# Altium project VFD_controller_stm.PrjPcb
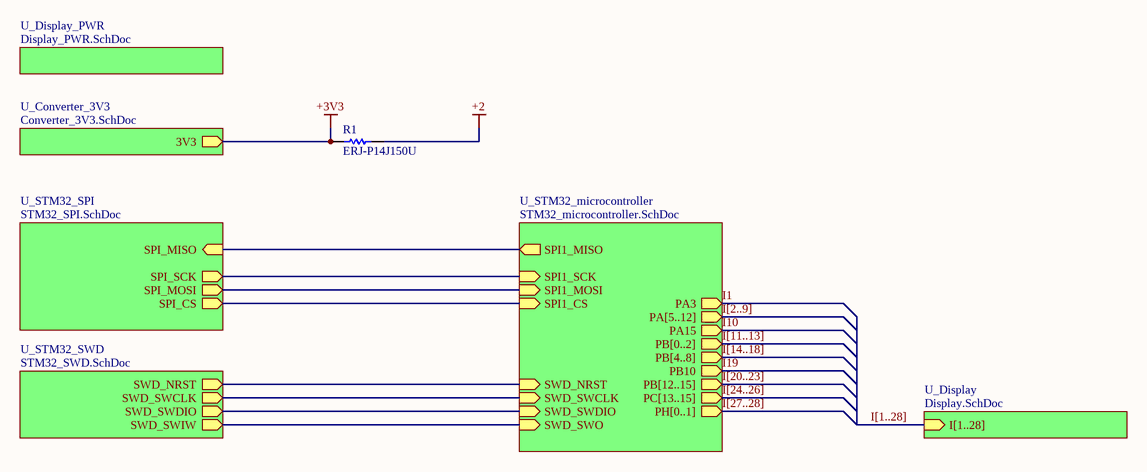
[diagram p0: Main.SchDoc]
7 sheets, 61 parts. Net scope: hierarchical (ports join the sheet entries above them; power ports are global).
Board file: VFD_controller.PcbDoc
Sheets:
  Main.SchDoc
    U_Converter_3V3 = Converter_3V3.SchDoc
    U_STM32_microcontroller = STM32_microcontroller.SchDoc
    U_STM32_SPI = STM32_SPI.SchDoc
    U_Display_PWR = Display_PWR.SchDoc
    U_Display = Display.SchDoc
    U_STM32_SWD = STM32_SWD.SchDoc

## Sheet Main.SchDoc
size A4; SheetNumber: 1; SheetTotal: 7

### Parts
R1  ERJ-P14J150U  [RESC3225X70X50ML20T20]

### Sub-sheets
U_Converter_3V3 = Converter_3V3.SchDoc: 3V3 (out)
U_Display = Display.SchDoc: I[1..28] (in)
U_Display_PWR = Display_PWR.SchDoc: no entries
U_STM32_microcontroller = STM32_microcontroller.SchDoc: SPI1_SCK (in), SPI1_MOSI (in), SPI1_MISO (out), SPI1_CS (in), SWD_SWDIO (in), SWD_SWCLK (in), SWD_NRST (in), SWD_SWO (in), PA3 (out), PA[5..12] (out), PA15 (out), PB[0..2] (out), PB[4..8] (out), PB10 (out), PB[12..15] (out), PC[13..15] (out), PH[0..1] (out)
U_STM32_SPI = STM32_SPI.SchDoc: SPI_SCK (out), SPI_MOSI (out), SPI_CS (out), SPI_MISO (in)
U_STM32_SWD = STM32_SWD.SchDoc: SWD_NRST (out), SWD_SWCLK (out), SWD_SWDIO (out), SWD_SWIW (out)

### Nets
+2: R1.2
+3V3: R1.1 ; sheet U_Converter_3V3/3V3
NRST: sheet U_STM32_microcontroller/SWD_NRST, sheet U_STM32_SWD/SWD_NRST
NetIC1_10: sheet U_STM32_microcontroller/SPI1_MISO, sheet U_STM32_SPI/SPI_MISO
NetIC1_11: sheet U_STM32_microcontroller/SPI1_CS, sheet U_STM32_SPI/SPI_CS
NetIC1_12: sheet U_STM32_microcontroller/SPI1_SCK, sheet U_STM32_SPI/SPI_SCK
NetIC1_14: sheet U_STM32_microcontroller/SPI1_MOSI, sheet U_STM32_SPI/SPI_MOSI
NetIC1_34: sheet U_STM32_microcontroller/SWD_SWDIO, sheet U_STM32_SWD/SWD_SWDIO
NetIC1_37: sheet U_STM32_microcontroller/SWD_SWCLK, sheet U_STM32_SWD/SWD_SWCLK
NetIC1_39: sheet U_STM32_microcontroller/SWD_SWO, sheet U_STM32_SWD/SWD_SWIW

### Buses and harness runs
bus I[1..28] = sheet U_Display/I[1..28]
bus I[2..9] = sheet U_STM32_microcontroller/PA[5..12]
bus I[11..13] = sheet U_STM32_microcontroller/PB[0..2]
bus I[14..18] = sheet U_STM32_microcontroller/PB[4..8]
bus I[20..23] = sheet U_STM32_microcontroller/PB[12..15]
bus I[24..26] = sheet U_STM32_microcontroller/PC[13..15]
bus I[27..28] = sheet U_STM32_microcontroller/PH[0..1]

### Library data of the parts
R1 = CMP-2005-03662-1: Manufacturer: Panasonic; Part Number: ERJ-P14J150U

## Sheet Converter_3V3.SchDoc
size A4; SheetNumber: 3; SheetTotal: 8
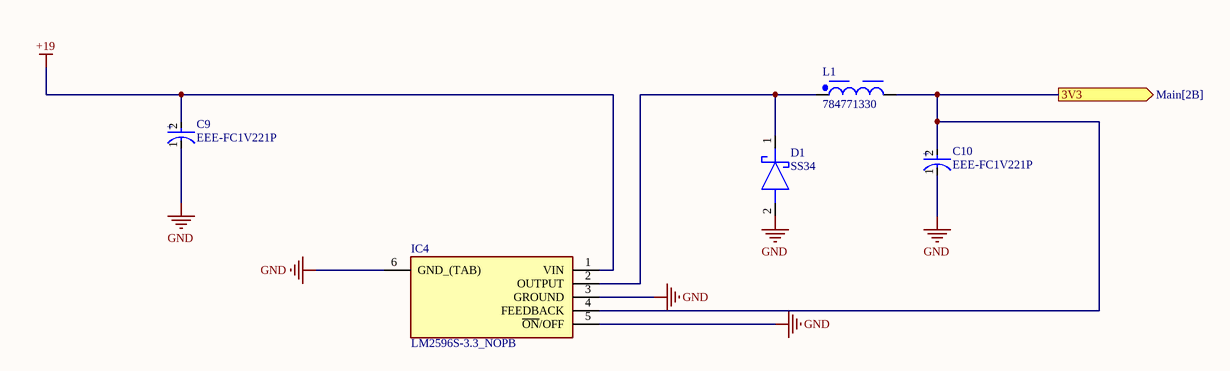
[diagram p1: Converter_3V3.SchDoc]

### Parts
C9  EEE-FC1V221P  [FP-FC-G-MFG]
C10  EEE-FC1V221P  [FP-FC-G-MFG]
D1  SS34  [DIOM8059X256N]
IC4  LM2596S-3.3_NOPB  [TO170P1435X465-6N]
L1  784771330  [WE-PDA_1260]

### Ports
3V3 (out, see Main[2B])

### Nets
+3V3: C10.2(A) IC4.4(FEEDBACK) L1.2 ; port 3V3
+19: C9.2(A) IC4.1(VIN)
GND: C9.1(C) C10.1(C) D1.2(A) IC4.3(GROUND) IC4.5(~{ON}/OFF) IC4.6(GND_(TAB))
NetD1_1: D1.1(K) IC4.2(OUTPUT) L1.1

### Notes on the sheet
- (in symbol CMP-05427-002152-1) +

### Library data of the parts
C9 C10 = CMP-05427-002152-1: CAP ALUM 220UF 20% 35V SMD; Life (Hours): 1000Hour; Leakage Current: 3uA; Ripple Current (AC): 670mA; Material: Aluminium; Impedance: 150mR; Mount: Surface Mount; Construction: Cylindrical; Ratings: AEC-Q200; Radiation Hardening: No; Height: 10.2mm; Height - Seated (Max): 0.402inch; Termination: SMD/SMT; Tolerance: 20%; Packaging: Tape and Reel; Min Operating Temperature: -40°C; Voltage: 35V; Case/Package: Radial; Length: 10.5mm; Ripple Current: 670mA; Contact Plating: Tin; Width: 900um; Capacitance: 220uF; Voltage Rating (DC): 35V; Diameter: 10mm; Package Quantity: 500; Lead Free: Lead Free; Reach SVHC Compliant: Yes; Series: FC; Max Operating Temperature: 105°C; Voltage Rating: 35V; RoHS Compliant: Yes; ESR (Equivalent Series Resistance): 150mR
D1 = SS34: Schottky Diode; Manufacturer_Name: onsemi; Datasheet Link: https://www.onsemi.com/pub/Collateral/SS39-D.PDF; Height: 2.56mm; Manufacturer_Part_Number: SS34; Mouser Part Number: 512-SS34; Mouser Price/Stock: https://www.mouser.co.uk/ProductDetail/onsemi-Fairchild/SS34?qs=2ONuHmP%2FXzb3ub11UdFfdQ%3D%3D; Arrow Part Number: SS34; Arrow Price/Stock: https://www.arrow.com/en/products/ss34/on-semiconductor?utm_currency=USD&region=nac
IC4 = LM2596S-3.3_NOPB: Integrated Circuit; Manufacturer_Name: Texas Instruments; Manufacturer_Part_Number: LM2596S-3.3/NOPB; Datasheet Link: http://www.ti.com/lit/ds/symlink/lm2596.pdf; Height: 4.65mm; Mouser Part Number: 926-LM2596S-3.3/NOPB; Mouser Price/Stock: https://www.mouser.co.uk/ProductDetail/Texas-Instruments/LM2596S-3.3-NOPB?qs=X1J7HmVL2ZHsEwG9Q6doow%3D%3D; Arrow Part Number: LM2596S-3.3/NOPB; Arrow Price/Stock: https://www.arrow.com/en/products/lm2596s-3.3nopb/texas-instruments?utm_currency=USD&region=nac
L1 = CMP-03913-88972560-2: 784771330 Power Inductor, 33Uh, Shielded, 2.8A Rohs Compliant: Yes; DC Resistance (DCR): 52mΩ; Inductance: 33µH; Number of Pins: 2; RoHS: Compliant; Length: 12mm; Min Operating Temperature: -40°C; Max Operating Temperature: 125°C; Ambient Temperature Range High: 85°C; NexarPartId: 88972560; Current Rating: 2.8A; Ambient Temperature Range Low: -40°C; Width: 12mm; Height: 6mm

## Sheet STM32_microcontroller.SchDoc
size A4; SheetNumber: 2; SheetTotal: 7
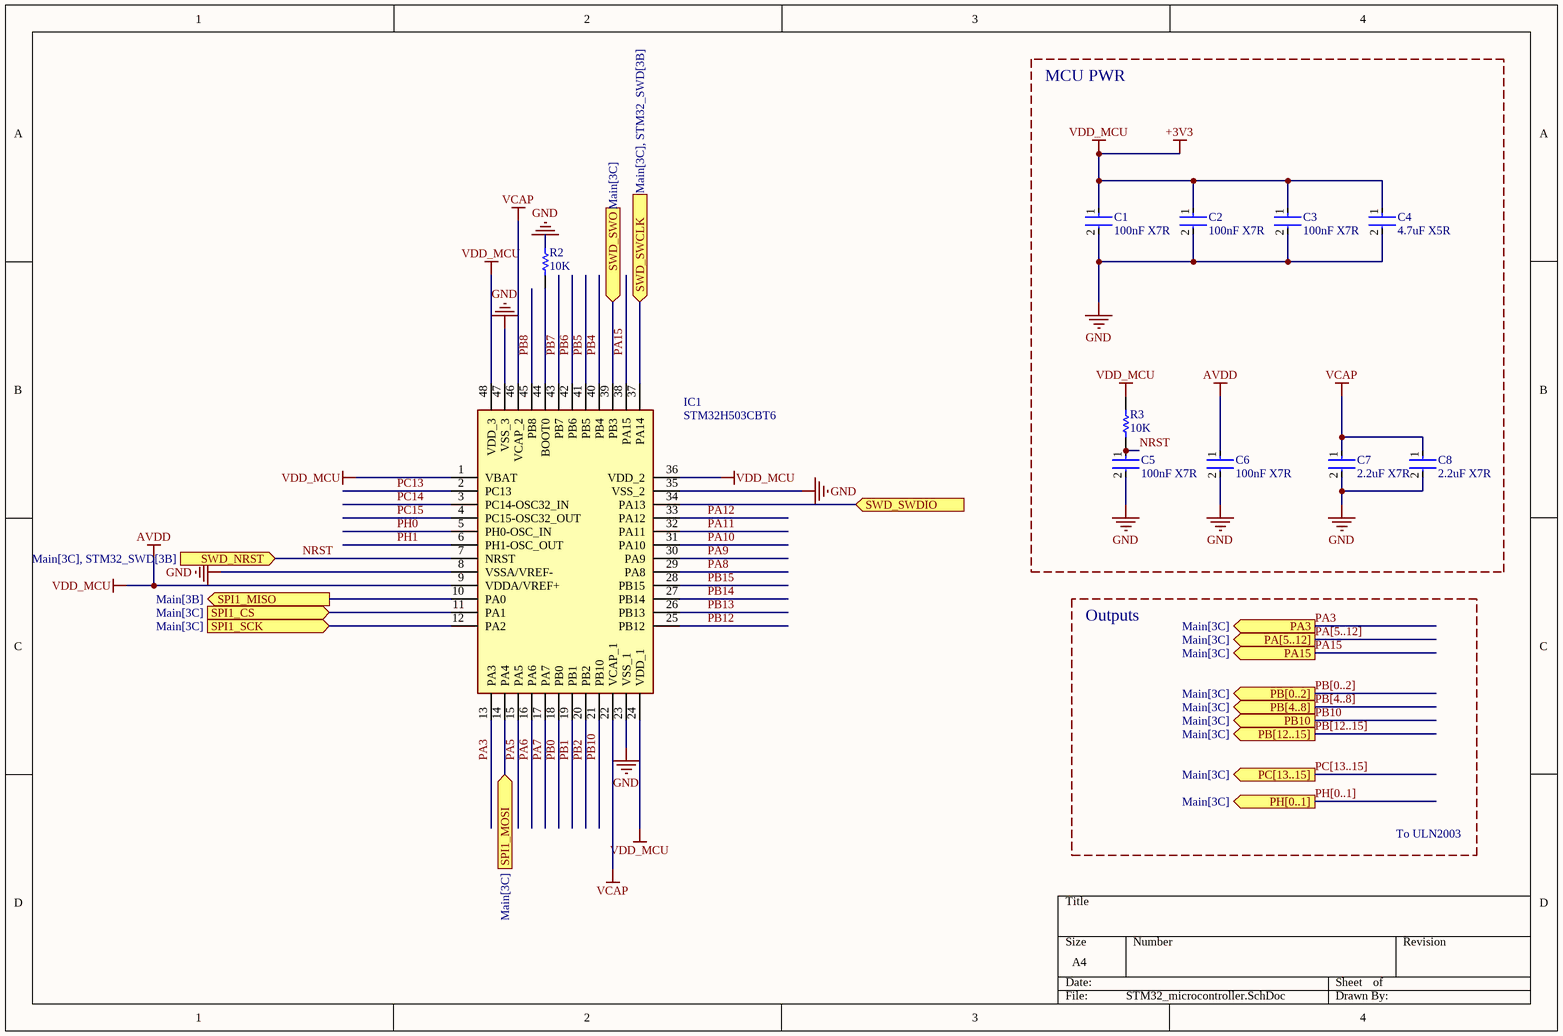
[diagram p2: STM32_microcontroller.SchDoc]

### Parts
C1  100nF X7R  [FP-CL10-IPC_C]
C2  100nF X7R  [FP-CL10-IPC_C]
C3  100nF X7R  [FP-CL10-IPC_C]
C4  4.7uF X5R  [FP-CL21-IPC_B]
C5  100nF X7R  [FP-CL10-IPC_C]
C6  100nF X7R  [FP-CL10-IPC_C]
C7  2.2uF X7R  [FP-CC0805-0_85-MFG]
C8  2.2uF X7R  [FP-CC0805-0_85-MFG]
IC1  STM32H503CBT6  [QFP50P900X900X160-48N]
R2  10K  [RESC1609X50X30ML10T20]
R3  10K  [RESC1609X50X30ML10T20]

### Blocks framed on the sheet
MCU PWR: C1-C8 R3

### Ports
PA3 (out, see Main[3C]), PA15 (out, see Main[3C]), PA[5..12] (out, see Main[3C]), PB10 (out, see Main[3C]), PB[0..2] (out, see Main[3C]), PB[4..8] (out, see Main[3C]), PB[12..15] (out, see Main[3C]), PC[13..15] (out, see Main[3C]), PH[0..1] (out, see Main[3C]), SPI1_CS (in, see Main[3C]), SPI1_MISO (out, see Main[3B]), SPI1_MOSI (in, see Main[3C]), SPI1_SCK (in, see Main[3C]), SWD_NRST (in, see Main[3C], STM32_SWD[3B]), SWD_SWCLK (in, see Main[3C], STM32_SWD[3B]), SWD_SWDIO (in, see Main[3C], STM32_SWD[3B]), SWD_SWO (in, see Main[3C])

### Nets
+3V3: C1.1 C2.1 C3.1 C4.1 C6.1 IC1.1(VBAT) IC1.9(VDDA/VREF+) IC1.24(VDD_1) IC1.36(VDD_2) IC1.48(VDD_3) R3.2  [also labelled AVDD, VDD_MCU]
GND: C1.2 C2.2 C3.2 C4.2 C5.2 C6.2 C7.2 C8.2 IC1.8(VSSA/VREF-) IC1.23(VSS_1) IC1.35(VSS_2) IC1.47(VSS_3) R2.2
VCAP: C7.1 C8.1 IC1.22(VCAP_1) IC1.46(VCAP_2)
NRST: C5.1 IC1.7(NRST) R3.1 ; port SWD_NRST
PA3: IC1.13(PA3) ; port PA3  [project net I1]
PA5: IC1.15(PA5)  [project net I2]
PA6: IC1.16(PA6)  [project net I3]
PA7: IC1.17(PA7)  [project net I4]
PA8: IC1.29(PA8)  [project net I5]
PA9: IC1.30(PA9)  [project net I6]
PA10: IC1.31(PA10)  [project net I7]
PA11: IC1.32(PA11)  [project net I8]
PA12: IC1.33(PA12)  [project net I9]
PA15: IC1.38(PA15) ; port PA15  [project net I10]
PB0: IC1.18(PB0)  [project net I11]
PB1: IC1.19(PB1)  [project net I12]
PB2: IC1.20(PB2)  [project net I13]
PB4: IC1.40(PB4)  [project net I14]
PB5: IC1.41(PB5)  [project net I15]
PB6: IC1.42(PB6)  [project net I16]
PB7: IC1.43(PB7)  [project net I17]
PB8: IC1.45(PB8)  [project net I18]
PB10: IC1.21(PB10) ; port PB10  [project net I19]
PB12: IC1.25(PB12)  [project net I20]
PB13: IC1.26(PB13)  [project net I21]
PB14: IC1.27(PB14)  [project net I22]
PB15: IC1.28(PB15)  [project net I23]
PC13: IC1.2(PC13)  [project net I24]
PC14: IC1.3(PC14-OSC32_IN)  [project net I25]
PC15: IC1.4(PC15-OSC32_OUT)  [project net I26]
PH0: IC1.5(PH0-OSC_IN)  [project net I27]
PH1: IC1.6(PH1-OSC_OUT)  [project net I28]
NetIC1_10: IC1.10(PA0) ; port SPI1_MISO
NetIC1_11: IC1.11(PA1) ; port SPI1_CS
NetIC1_12: IC1.12(PA2) ; port SPI1_SCK
NetIC1_14: IC1.14(PA4) ; port SPI1_MOSI
NetIC1_34: IC1.34(PA13) ; port SWD_SWDIO
NetIC1_37: IC1.37(PA14) ; port SWD_SWCLK
NetIC1_39: IC1.39(PB3) ; port SWD_SWO
NetIC1_44: IC1.44(BOOT0) R2.1

### Buses and harness runs
bus PA[5..12] = port PA[5..12]
bus PB[0..2] = port PB[0..2]
bus PB[4..8] = port PB[4..8]
bus PB[12..15] = port PB[12..15]
bus PC[13..15] = port PC[13..15]
bus PH[0..1] = port PH[0..1]

### Notes on the sheet
- Outputs
- To ULN2003

### Library data of the parts
C1-C3 C5 C6 = CMP-13271-001423-1: Cap Ceramic 100nF 25V X7R ±10% Pad SMD 0603 +125°C T/R; Depth: 0.8mm; Tolerance: 10%; Case Code (Imperial): 0603; Max Operating Temperature: 125°C; Min Operating Temperature: -55°C; Dielectric: X7R; Width: 0.031inch; Thickness: 0.035inch; Height: 0.8mm; Length: 1.6mm; Mount: Surface Mount; Capacitance: 100nF; Voltage Rating: 25V; Case Code (Metric): 1608; Case/Package: 0603; Radiation Hardening: No; Packaging: Tape and Reel
C4 = CMP-13271-001343-1: CL21 Series 0805 4.7uF 6.3V ±10% Tolerance X5R Multilayer Ceramic Chip Capacitor; Case/Package: 0805; Capacitance: 4.7uF; Length: 2mm; Width: 0.049inch; Thickness: 0.053inch; Package Quantity: 10000; Voltage Rating: 6.3V; Depth: 1.25mm; Radiation Hardening: No; Tolerance: 10%; Dielectric: X5R; Height: 1.25mm; Packaging: Tape and Reel; Min Operating Temperature: -55°C; Max Operating Temperature: 85°C; Mount: Surface Mount
C7 C8 = CMP-03422-000945-1: CAP CER 2.2UF 6.3V X7R 0805; Manufacturer Part Number: CC0805KKX7R5BB225; Manufacturer: Yageo; Tolerance: 0.1; Material: Ceramic; ComponentLink2URL: http://www.yageo.com/documents/recent/UPY-GPHC_Y5V_6.3V-to-50V_8.pdf; Package: CC0805-0.85; Temperature Range Low: -30°C; Temperature: -30°C to +85°C; Footprint Url: http://www.yageo.com/exep/pages/download/literatures/UPY-C_GEN_24.pdf; Category: Cap; Lead Free: Yes; Temperature Range High: +85°C; Octopart: https://octopart.com/cc0805kkx7r5bb225-yageo-29810442; Ipc Land Pattern Name: CAPC200125X85; RoHS: TRUE; Capacitance: 2.2 uF; Height: 0.95mm; Value: 2.2 uF; Device Class L1: Passive Components; Automotive: No; Temperature Characteristic: X7R; Device Class L3: Ceramic Capacitors; Voltage Rating: 6.3 V; ComponentLink2Description: Datasheet; Device Class L2: Capacitors; Mouser Description: Multilayer Ceramic Capacitors MLCC - SMD/SMT 2.2uF 6.3V X7R 10%; Digikey Description: CAP CER 2.2UF 6.3V X7R 0805
IC1 = STM32H503CBT6: Integrated Circuit; Manufacturer_Name: STMicroelectronics; Datasheet Link: https://www.st.com/en/microcontrollers-microprocessors/stm32h503cb.html; Height: 1.6mm; Manufacturer_Part_Number: STM32H503CBT6; Mouser Part Number: 511-STM32H503CBT6; Mouser Price/Stock: https://www.mouser.co.uk/ProductDetail/STMicroelectronics/STM32H503CBT6?qs=amGC7iS6iy99sz%2FXgeIPHg%3D%3D; Arrow Part Number: STM32H503CBT6; Arrow Price/Stock: https://www.arrow.com/en/products/stm32h503cbt6/stmicroelectronics?utm_currency=USD&region=nac
R2 R3 = CMP-2000-03837-1: Manufacturer: Vishay Dale; Part Number: CRCW060310K0FKTB

## Sheet STM32_SPI.SchDoc
size A4; SheetNumber: 6; SheetTotal: 8
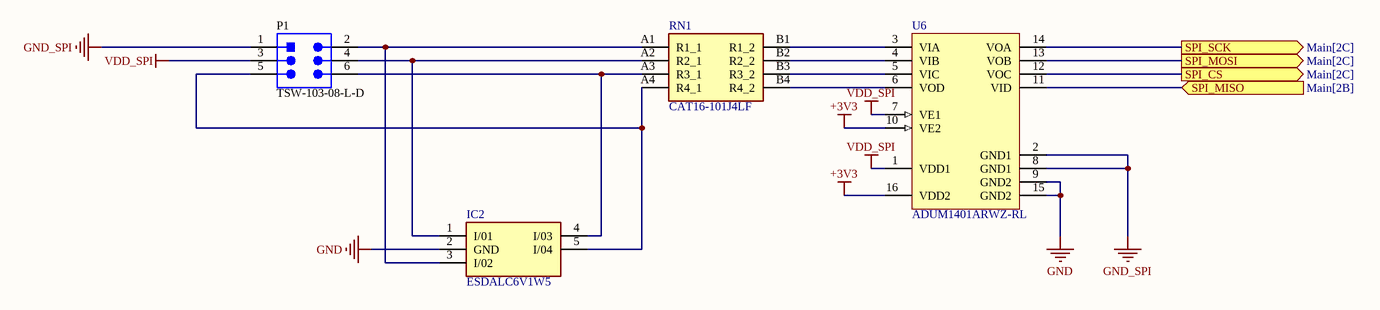
[diagram p3: STM32_SPI.SchDoc]

### Parts
IC2  ESDALC6V1W5  [SOT65P210X110-5N]
P1  TSW-103-08-L-D  [SMTC-TSW-103-08-L-D_V]
RN1  CAT16-101J4LF  [CAT16101J4LF]
U6  ADUM1401ARWZ-RL  [ADI-RW-16_N]

### Ports
SPI_CS (out, see Main[2C]), SPI_MISO (in, see Main[2B]), SPI_MOSI (out, see Main[2C]), SPI_SCK (out, see Main[2C])

### Nets
+3V3: U6.10(VE2) U6.16(VDD2)
GND: IC2.2(GND) U6.9(GND2) U6.15(GND2)
GND_SPI: P1.1 U6.2(GND1) U6.8(GND1)
VDD_SPI: P1.3 U6.1(VDD1) U6.7(VE1)
NetIC1_10: U6.11(VID) ; port SPI_MISO
NetIC1_11: U6.12(VOC) ; port SPI_CS
NetIC1_12: U6.14(VOA) ; port SPI_SCK
NetIC1_14: U6.13(VOB) ; port SPI_MOSI
NetIC2_1: IC2.1(I/01) P1.4 RN1.A2(R2_1)
NetIC2_3: IC2.3(I/02) P1.2 RN1.A1(R1_1)
NetIC2_4: IC2.4(I/03) P1.6 RN1.A3(R3_1)
NetIC2_5: IC2.5(I/04) P1.5 RN1.A4(R4_1)
NetRN1_B1: RN1.B1(R1_2) U6.3(VIA)
NetRN1_B2: RN1.B2(R2_2) U6.4(VIB)
NetRN1_B3: RN1.B3(R3_2) U6.5(VIC)
NetRN1_B4: RN1.B4(R4_2) U6.6(VOD)

### Library data of the parts
IC2 = ESDALC6V1W5: Integrated Circuit; Manufacturer_Name: STMicroelectronics; Datasheet Link: http://www.st.com/web/en/resource/technical/document/datasheet/CD00002946.pdf; Height: 1.1mm; Manufacturer_Part_Number: ESDALC6V1W5; Mouser Part Number: 511-ESDALC6V1W5; Mouser Price/Stock: https://www.mouser.co.uk/ProductDetail/STMicroelectronics/ESDALC6V1W5?qs=C%2FEejvvdwQ4xcyFnfrFaDw%3D%3D; Arrow Part Number: ESDALC6V1W5; Arrow Price/Stock: https://www.arrow.com/en/products/esdalc6v1w5/stmicroelectronics?utm_currency=USD&region=nac
P1 = CMP-1024-00336-5: Male Header, Pitch 2.54 mm, 2 x 3 Position, Height 8.38 mm, Tail Length 5.08 mm, -55 to 125 degC, RoHS, Bulk; Manufacturer: Samtec; DatasheetVersion: 04/2012; ComponentLink3URL: http://suddendocs.samtec.com/prints/tsw-xxx-xx-x-x-xx-xxx-footprint.pdf; PackageReference: TSW-103-08-L-D; Mounting Technology: Through Hole; Min Operating Temperature: -55 degC; ComponentLink2Description: Datasheet; Lead Pitch: 2.54 mm; ComponentLink1Description: Manufacturer URL; Mount: Through Hole; ComponentLink1URL: http://www.samtec.com/; ComponentLink3Description: Package Specification; Max Operating Temperature: 125 degC; PackageDescription: Male Header, Pitch 2.54 mm, 2 x 3 Position, Height 8.38 mm, Tail Length 5.08 mm; ComponentLink2URL: https://datasheet.ciiva.com/25618/0900766b81154476-25618436.pdf; RoHSCompliant: true
RN1 = CAT16-101J4LF: Resistor Network; Manufacturer_Name: Bourns; Datasheet Link: https://datasheet.datasheetarchive.com/originals/distributors/SFDatasheet-7/sf-000140092.pdf; Height: 0.5mm; Manufacturer_Part_Number: CAT16-101J4LF; Mouser Part Number: 652-CAT16-101J4LF; Mouser Price/Stock: https://www.mouser.co.uk/ProductDetail/Bourns/CAT16-101J4LF?qs=Fn3VdHBzkcn2is%252B1oonJSQ%3D%3D; Arrow Part Number: CAT16-101J4LF; Arrow Price/Stock: https://www.arrow.com/en/products/cat16-101j4lf/bourns?region=nac
U6 = CMP-0534-00564-1: Quad Channel Digital Isolator, 2.5 KV rms Insulation Rating, 1 Mbps Data Rate, 100 ns Delay, Industrial, 16-pin SOIC (RW-16), Reel; Manufacturer: Analog Devices; Max Data Rate: 1Mbps; ComponentLink4URL: Product URL:http://www.analog.com/en/interface-isolation/digital-isolators/adum1401/products/product.html; ComponentLink1Description: Manufacturer URL; ComponentLink4Description: URL Link1; Code_JEDEC: MS-013-AA; Max Operating Temp (degreesC): 125; ComponentLink2Description: Datasheet; ComponentLink3URL: http://www.analog.com/static/imported-files/packages/PKG_PDF/SOIC_WIDE%20%28RW%29/RW_16.pdf; PackageVersion: 032707-B, 03/2007; PartNumber: ADUM1401ARWZ-RL; ComponentLink2URL: http://www.analog.com/static/imported-files/data_sheets/ADuM1400_1401_1402.pdf; ComponentLink5Description: URL Link2; ComponentLink1URL: http://www.analog.com/en/index.html; PackageReference: RW-16; ComponentLink5URL: Reference Circuit:http://www.analog.com/en/interface-isolation/digital-isolators/adum1401/products/product.html#product-recommendations; DatasheetVersion: Rev. H; ComponentLink3Description: Package Specification; Mounting Technology: Surface Mount; PackageDescription: 16-Pin Standard Small Outline Package, Body 10.3 x 7.5 mm, Pitch 1.27 mm

## Sheet Display_PWR.SchDoc
size A4; SheetNumber: 8; SheetTotal: 8
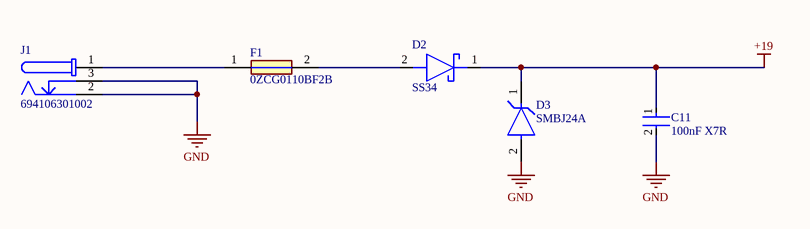
[diagram p4: Display_PWR.SchDoc]

### Parts
C11  100nF X7R  [FP-CL10-IPC_C]
D2  SS34  [DIOM8059X256N]
D3  SMBJ24A  [FP-SMBJ-MFG]
F1  0ZCG0110BF2B  [FUSC4632X130N]
J1  694106301002  [694106301002]

### Nets
+19: C11.1 D2.1(K) D3.1(C)
GND: C11.2 D3.2(A) J1.2 J1.3
NetD2_2: D2.2(A) F1.2
NetF1_1: F1.1 J1.1

### Library data of the parts
C11 = CMP-13271-001423-1: as C1 on sheet STM32_microcontroller; Depth: 0.8mm; Tolerance: 10%; Case Code (Imperial): 0603; Max Operating Temperature: 125°C; Min Operating Temperature: -55°C; Dielectric: X7R; Width: 0.031inch; Thickness: 0.035inch; Height: 0.8mm; Length: 1.6mm; Mount: Surface Mount; Capacitance: 100nF; Voltage Rating: 25V; Case Code (Metric): 1608; Case/Package: 0603; Radiation Hardening: No; Packaging: Tape and Reel
D2 = SS34: as D1 on sheet Converter_3V3; Datasheet Link: https://www.onsemi.com/pub/Collateral/SS39-D.PDF; Height: 2.56mm; Manufacturer_Part_Number: SS34; Mouser Part Number: 512-SS34; Mouser Price/Stock: https://www.mouser.co.uk/ProductDetail/onsemi-Fairchild/SS34?qs=2ONuHmP%2FXzb3ub11UdFfdQ%3D%3D; Arrow Part Number: SS34; Arrow Price/Stock: https://www.arrow.com/en/products/ss34/on-semiconductor?utm_currency=USD&region=nac
D3 = CMP-07401-000035-1: TVS DIODE 24V 38.9V SMB; Max Breakdown Voltage: 30.7V; Operating Supply Voltage: 3.5V; Min Breakdown Voltage: 26.7V; Test Current: 1mA; Direction: Unidirectional; Peak Pulse Current: 15.4A; Peak Pulse Power: 600W; Number of Unidirectional Channels: 1; Element Configuration: Single; Power Line Protection: No; Diode Type: ZENER; Leakage Current: 5uA; Max Surge Current: 100A; ESD Protection: Yes; Width: 3.94mm; Number of Pins: 2; Clamping Voltage: 38.9V; Reverse Standoff Voltage: 24V; Breakdown Voltage: 30.7V; RoHS Compliant: Yes; Package Quantity: 1; Case/Package: SMB; Mount: Surface Mount; Resistor Type: Zener; Packaging: Tape and Reel; Reverse Breakdown Voltage: 26.7V; Series: SMBJ; Radiation Hardening: No; Max Operating Temperature: 150°C; Termination: SMD/SMT; Number of Channels: 1; Length: 4.57mm; REACH SVHC: No SVHC; Number of Elements: 1; Polarity: Unidirectional; Height: 2.42mm; Max Power Dissipation: 600W; Max Reverse Leakage Current: 5uA; Min Operating Temperature: -55°C
F1 = 0ZCG0110BF2B: Fuse; Manufacturer_Name: BelFuse; Datasheet Link: https://datasheet.datasheetarchive.com/originals/distributors/Datasheets_SAMA/44944b3a27f8483a7253631e04029a1a.pdf; Height: 1.3mm; Manufacturer_Part_Number: 0ZCG0110BF2B; Mouser Part Number: 530-0ZCG0110BF2B; Mouser Price/Stock: https://www.mouser.co.uk/ProductDetail/Bel-Fuse/0ZCG0110BF2B?qs=SRYZG9HaIQ2Phb8oqvu9NQ%3D%3D; Arrow Part Number: 0ZCG0110BF2B; Arrow Price/Stock: https://www.arrow.com/en/products/0zcg0110bf2b/bel-group
J1 = CMP-1502-00188-2: NexarPartId: 52676100; Voltage Rating (DC): 20V; Gender: Male; Voltage Rating: 24V; Connector Type: Power; Insulation Resistance: 100MΩ; Current Rating: 5A; Shielding: Unshielded; Number of Contacts: 3; Color: Black; Housing Material: Polyamide; Contact Gender: Female; REACH SVHC: Unknown; Termination: Through Hole; Height: 11mm; RoHS: Compliant; Mount: Through Hole; Flammability Rating: UL94 V-0; Packaging: Bulk; Min Operating Temperature: -40°C; Contact Plating: Tin; Max Operating Temperature: 85°C; Operating Supply Voltage: 24V; Contact Material: Gold, Tin

## Sheet Display.SchDoc
size A4; SheetNumber: 4; SheetTotal: 7
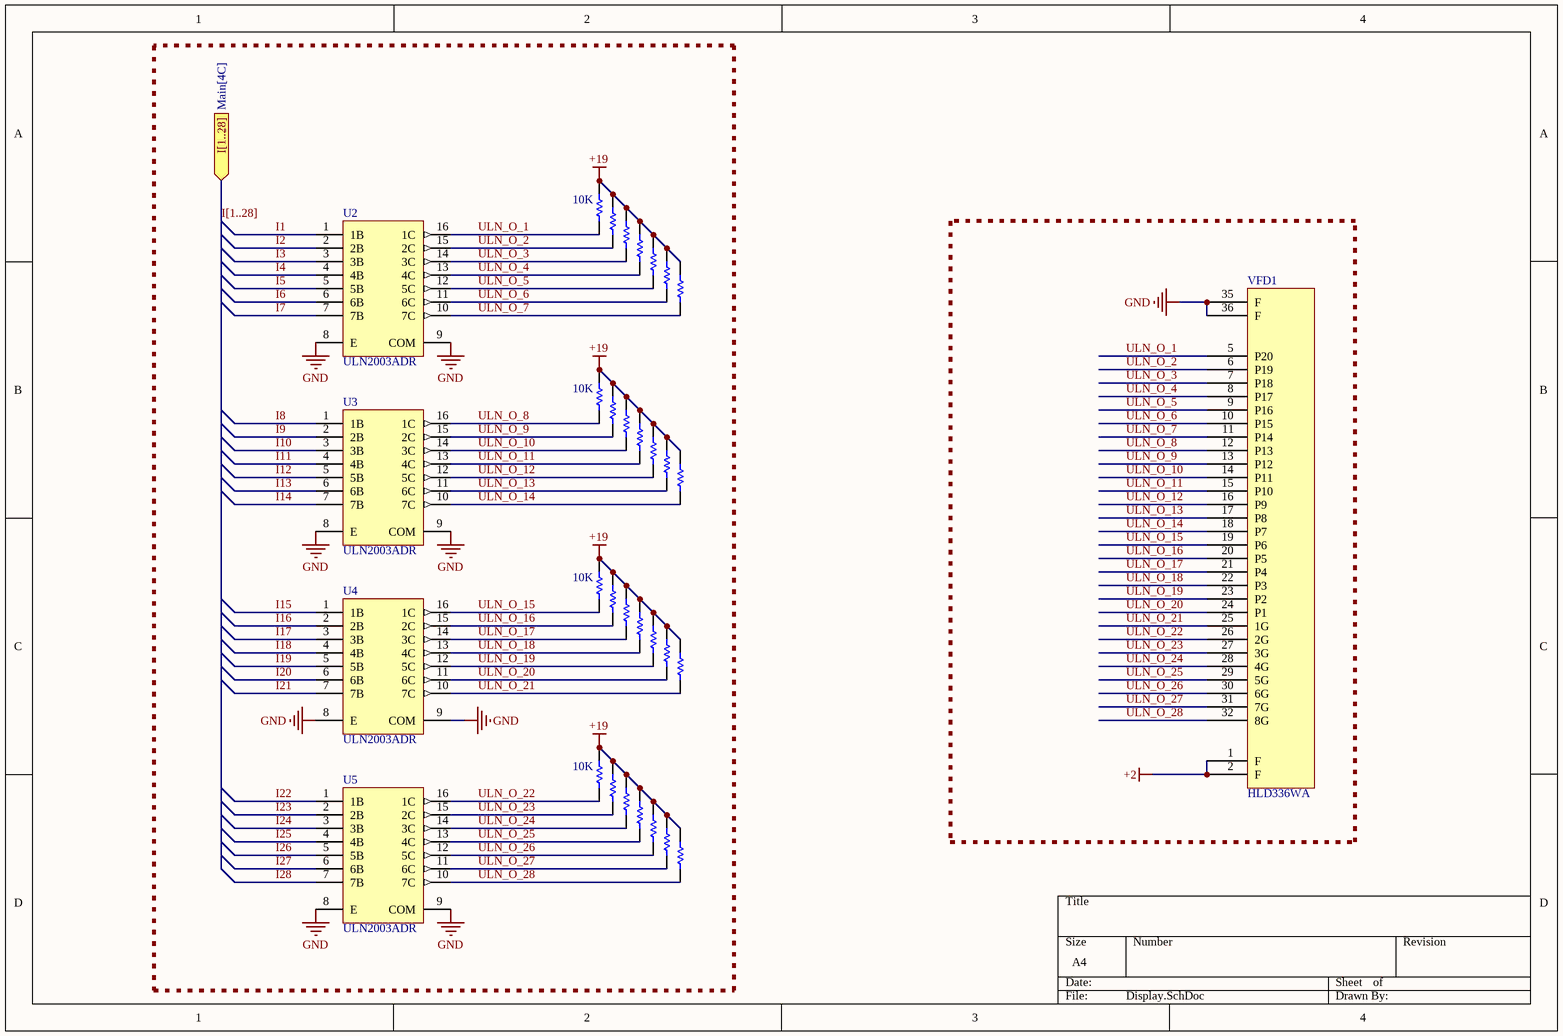
[diagram p5: Display.SchDoc]

### Parts
R4  10K  [RESC1609X50X30ML10T20]  (value not drawn)
R5  10K  [RESC1609X50X30ML10T20]
R6  10K  [RESC1609X50X30ML10T20]  (value not drawn)
R7  10K  [RESC1609X50X30ML10T20]  (value not drawn)
R8  10K  [RESC1609X50X30ML10T20]  (value not drawn)
R9  10K  [RESC1609X50X30ML10T20]  (value not drawn)
R10  10K  [RESC1609X50X30ML10T20]  (value not drawn)
R11  10K  [RESC1609X50X30ML10T20]  (value not drawn)
R12  10K  [RESC1609X50X30ML10T20]
R13  10K  [RESC1609X50X30ML10T20]  (value not drawn)
R14  10K  [RESC1609X50X30ML10T20]  (value not drawn)
R15  10K  [RESC1609X50X30ML10T20]  (value not drawn)
R16  10K  [RESC1609X50X30ML10T20]  (value not drawn)
R17  10K  [RESC1609X50X30ML10T20]  (value not drawn)
R18  10K  [RESC1609X50X30ML10T20]  (value not drawn)
R19  10K  [RESC1609X50X30ML10T20]
R20  10K  [RESC1609X50X30ML10T20]  (value not drawn)
R21  10K  [RESC1609X50X30ML10T20]  (value not drawn)
R22  10K  [RESC1609X50X30ML10T20]  (value not drawn)
R23  10K  [RESC1609X50X30ML10T20]  (value not drawn)
R24  10K  [RESC1609X50X30ML10T20]  (value not drawn)
R25  10K  [RESC1609X50X30ML10T20]
R26  10K  [RESC1609X50X30ML10T20]  (value not drawn)
R27  10K  [RESC1609X50X30ML10T20]  (value not drawn)
R28  10K  [RESC1609X50X30ML10T20]  (value not drawn)
R29  10K  [RESC1609X50X30ML10T20]  (value not drawn)
R30  10K  [RESC1609X50X30ML10T20]  (value not drawn)
R31  10K  [RESC1609X50X30ML10T20]  (value not drawn)
U2  ULN2003ADR  [D0016A_M]
U3  ULN2003ADR  [D0016A_M]
U4  ULN2003ADR  [D0016A_M]
U5  ULN2003ADR  [D0016A_M]
VFD1  HLD336WA  [DIP72]

### Ports
I[1..28] (in, see Main[4C])

### Nets
+2: VFD1.1(F) VFD1.2(F)
+19: R4.1 R5.1 R6.1 R7.1 R8.1 R9.1 R10.1 R11.1 R12.1 R13.1 R14.1 R15.1 R16.1 R17.1 R18.1 R19.1 R20.1 R21.1 R22.1 R23.1 R24.1 R25.1 R26.1 R27.1 R28.1 R29.1 R30.1 R31.1
GND: U2.8(E) U2.9(COM) U3.8(E) U3.9(COM) U4.8(E) U4.9(COM) U5.8(E) U5.9(COM) VFD1.35(F) VFD1.36(F)
I1: U2.1(1B)
I2: U2.2(2B)
I3: U2.3(3B)
I4: U2.4(4B)
I5: U2.5(5B)
I6: U2.6(6B)
I7: U2.7(7B)
I8: U3.1(1B)
I9: U3.2(2B)
I10: U3.3(3B)
I11: U3.4(4B)
I12: U3.5(5B)
I13: U3.6(6B)
I14: U3.7(7B)
I15: U4.1(1B)
I16: U4.2(2B)
I17: U4.3(3B)
I18: U4.4(4B)
I19: U4.5(5B)
I20: U4.6(6B)
I21: U4.7(7B)
I22: U5.1(1B)
I23: U5.2(2B)
I24: U5.3(3B)
I25: U5.4(4B)
I26: U5.5(5B)
I27: U5.6(6B)
I28: U5.7(7B)
ULN_O_1: R5.2 U2.16(1C) VFD1.5(P20)
ULN_O_2: R6.2 U2.15(2C) VFD1.6(P19)
ULN_O_3: R7.2 U2.14(3C) VFD1.7(P18)
ULN_O_4: R8.2 U2.13(4C) VFD1.8(P17)
ULN_O_5: R9.2 U2.12(5C) VFD1.9(P16)
ULN_O_6: R10.2 U2.11(6C) VFD1.10(P15)
ULN_O_7: R11.2 U2.10(7C) VFD1.11(P14)
ULN_O_8: R12.2 U3.16(1C) VFD1.12(P13)
ULN_O_9: R13.2 U3.15(2C) VFD1.13(P12)
ULN_O_10: R14.2 U3.14(3C) VFD1.14(P11)
ULN_O_11: R15.2 U3.13(4C) VFD1.15(P10)
ULN_O_12: R16.2 U3.12(5C) VFD1.16(P9)
ULN_O_13: R17.2 U3.11(6C) VFD1.17(P8)
ULN_O_14: R18.2 U3.10(7C) VFD1.18(P7)
ULN_O_15: R19.2 U4.16(1C) VFD1.19(P6)
ULN_O_16: R20.2 U4.15(2C) VFD1.20(P5)
ULN_O_17: R21.2 U4.14(3C) VFD1.21(P4)
ULN_O_18: R22.2 U4.13(4C) VFD1.22(P3)
ULN_O_19: R23.2 U4.12(5C) VFD1.23(P2)
ULN_O_20: R24.2 U4.11(6C) VFD1.24(P1)
ULN_O_21: R4.2 U4.10(7C) VFD1.25(1G)
ULN_O_22: R25.2 U5.16(1C) VFD1.26(2G)
ULN_O_23: R26.2 U5.15(2C) VFD1.27(3G)
ULN_O_24: R27.2 U5.14(3C) VFD1.28(4G)
ULN_O_25: R28.2 U5.13(4C) VFD1.29(5G)
ULN_O_26: R29.2 U5.12(5C) VFD1.30(6G)
ULN_O_27: R30.2 U5.11(6C) VFD1.31(7G)
ULN_O_28: R31.2 U5.10(7C) VFD1.32(8G)

### Buses and harness runs
bus I[1..28] = port I[1..28]

### Library data of the parts
R4-R31 = CMP-2000-03837-1: as R2 on sheet STM32_microcontroller
U2-U5 = CMP-2000-04953-1: High-Voltage, High-Current Darlington Transistor Array, 0.5 A, 50 V, -20 to 70 degC, 16-Pin SOIC (D), Green (RoHS & no Sb/Br), Tape and Reel; Manufacturer: TexasInstruments; Peak DC Collector Current: 0.5A; Package Version: 4040047-6/M, 06/2011; Maximum Collector Emitter Voltage: 50V; Configuration: Array7; Maximum Collector Emitter Saturation Voltage: 1.1@100mA; Rad Hard: No; Packaging: Tape&Reel; Datasheet URL: http://www.ti.com/general/docs/lit/getliterature.tsp?genericPartNumber=uln2003a&fileType=pdf; Package Reference: D16; Category: DarlingtonBJT; Datasheet Version: Rev. O, 01/2016; Manufacturer URL: http://www.ti.com/; Type: NPN; Package Description: 16-Pin Plastic Small Outline, Body 9.9 x 3.9 mm, Pitch 1.27 mm; Mounting: SurfaceMount; Package: 16SOIC; Package URL: http://www.ti.com/lit/ml/mpds178g/mpds178g.pdf

## Sheet STM32_SWD.SchDoc
size A4; SheetNumber: 7; SheetTotal: 8
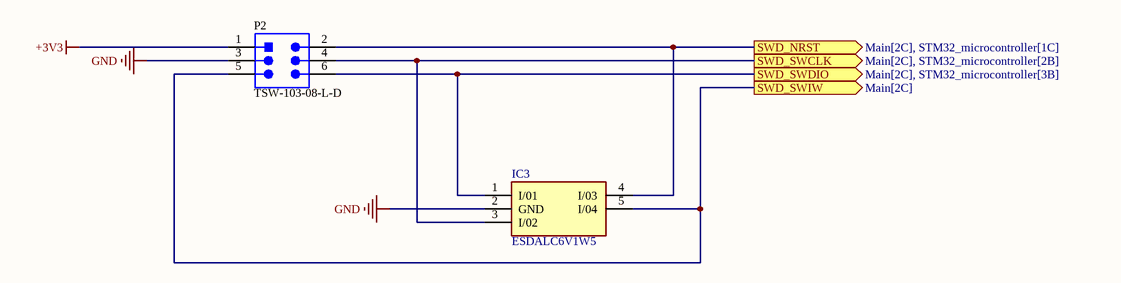
[diagram p6: STM32_SWD.SchDoc]

### Parts
IC3  ESDALC6V1W5  [SOT65P210X110-5N]
P2  TSW-103-08-L-D  [SMTC-TSW-103-08-L-D_V]

### Ports
SWD_NRST (out, see Main[2C], STM32_microcontroller[1C]), SWD_SWCLK (out, see Main[2C], STM32_microcontroller[2B]), SWD_SWDIO (out, see Main[2C], STM32_microcontroller[3B]), SWD_SWIW (out, see Main[2C])

### Nets
+3V3: P2.1
GND: IC3.2(GND) P2.3
NRST: IC3.4(I/03) P2.2 ; port SWD_NRST
NetIC1_34: IC3.1(I/01) P2.6 ; port SWD_SWDIO
NetIC1_37: IC3.3(I/02) P2.4 ; port SWD_SWCLK
NetIC1_39: IC3.5(I/04) P2.5 ; port SWD_SWIW

### Library data of the parts
IC3 = ESDALC6V1W5: as IC2 on sheet STM32_SPI; Datasheet Link: http://www.st.com/web/en/resource/technical/document/datasheet/CD00002946.pdf; Height: 1.1mm; Manufacturer_Part_Number: ESDALC6V1W5; Mouser Part Number: 511-ESDALC6V1W5; Mouser Price/Stock: https://www.mouser.co.uk/ProductDetail/STMicroelectronics/ESDALC6V1W5?qs=C%2FEejvvdwQ4xcyFnfrFaDw%3D%3D; Arrow Part Number: ESDALC6V1W5; Arrow Price/Stock: https://www.arrow.com/en/products/esdalc6v1w5/stmicroelectronics?utm_currency=USD&region=nac
P2 = CMP-1024-00336-5: as P1 on sheet STM32_SPI; DatasheetVersion: 04/2012; ComponentLink3URL: http://suddendocs.samtec.com/prints/tsw-xxx-xx-x-x-xx-xxx-footprint.pdf; PackageReference: TSW-103-08-L-D; Mounting Technology: Through Hole; Min Operating Temperature: -55 degC; ComponentLink2Description: Datasheet; Lead Pitch: 2.54 mm; ComponentLink1Description: Manufacturer URL; Mount: Through Hole; ComponentLink1URL: http://www.samtec.com/; ComponentLink3Description: Package Specification; Max Operating Temperature: 125 degC; PackageDescription: Male Header, Pitch 2.54 mm, 2 x 3 Position, Height 8.38 mm, Tail Length 5.08 mm; ComponentLink2URL: https://datasheet.ciiva.com/25618/0900766b81154476-25618436.pdf; RoHSCompliant: true

## Nets that join several sheets
+2: Main (R1.2), Display (VFD1.1 VFD1.2)
+3V3: Main (R1.1), Converter_3V3 (C10.2 IC4.4 L1.2), STM32_microcontroller (11 pins), STM32_SPI (U6.10 U6.16), STM32_SWD (P2.1)
+19: Converter_3V3 (C9.2 IC4.1), Display_PWR (C11.1 D2.1 D3.1), Display (28 pins)
GND: Converter_3V3 (6 pins), STM32_microcontroller (13 pins), STM32_SPI (IC2.2 U6.9 U6.15), Display_PWR (C11.2 D3.2 J1.2 J1.3), Display (10 pins), STM32_SWD (IC3.2 P2.3)
I1: STM32_microcontroller (IC1.13), Display (U2.1)
I2: STM32_microcontroller (IC1.15), Display (U2.2)
I3: STM32_microcontroller (IC1.16), Display (U2.3)
I4: STM32_microcontroller (IC1.17), Display (U2.4)
I5: STM32_microcontroller (IC1.29), Display (U2.5)
I6: STM32_microcontroller (IC1.30), Display (U2.6)
I7: STM32_microcontroller (IC1.31), Display (U2.7)
I8: STM32_microcontroller (IC1.32), Display (U3.1)
I9: STM32_microcontroller (IC1.33), Display (U3.2)
I10: STM32_microcontroller (IC1.38), Display (U3.3)
I11: STM32_microcontroller (IC1.18), Display (U3.4)
I12: STM32_microcontroller (IC1.19), Display (U3.5)
I13: STM32_microcontroller (IC1.20), Display (U3.6)
I14: STM32_microcontroller (IC1.40), Display (U3.7)
I15: STM32_microcontroller (IC1.41), Display (U4.1)
I16: STM32_microcontroller (IC1.42), Display (U4.2)
I17: STM32_microcontroller (IC1.43), Display (U4.3)
I18: STM32_microcontroller (IC1.45), Display (U4.4)
I19: STM32_microcontroller (IC1.21), Display (U4.5)
I20: STM32_microcontroller (IC1.25), Display (U4.6)
I21: STM32_microcontroller (IC1.26), Display (U4.7)
I22: STM32_microcontroller (IC1.27), Display (U5.1)
I23: STM32_microcontroller (IC1.28), Display (U5.2)
I24: STM32_microcontroller (IC1.2), Display (U5.3)
I25: STM32_microcontroller (IC1.3), Display (U5.4)
I26: STM32_microcontroller (IC1.4), Display (U5.5)
I27: STM32_microcontroller (IC1.5), Display (U5.6)
I28: STM32_microcontroller (IC1.6), Display (U5.7)
NetIC1_10: STM32_microcontroller (IC1.10), STM32_SPI (U6.11)
NetIC1_11: STM32_microcontroller (IC1.11), STM32_SPI (U6.12)
NetIC1_12: STM32_microcontroller (IC1.12), STM32_SPI (U6.14)
NetIC1_14: STM32_microcontroller (IC1.14), STM32_SPI (U6.13)
NetIC1_34: STM32_microcontroller (IC1.34), STM32_SWD (IC3.1 P2.6)
NetIC1_37: STM32_microcontroller (IC1.37), STM32_SWD (IC3.3 P2.4)
NetIC1_39: STM32_microcontroller (IC1.39), STM32_SWD (IC3.5 P2.5)
NRST: STM32_microcontroller (C5.1 IC1.7 R3.1), STM32_SWD (IC3.4 P2.2)